# Altium schematic sheet MCU_64.SchDoc: MCU
size A4; DocumentNumber: MB1136; Revision: C.3; SheetNumber: 2; SheetTotal: 4; Project: NUCLEO-XXXXRX
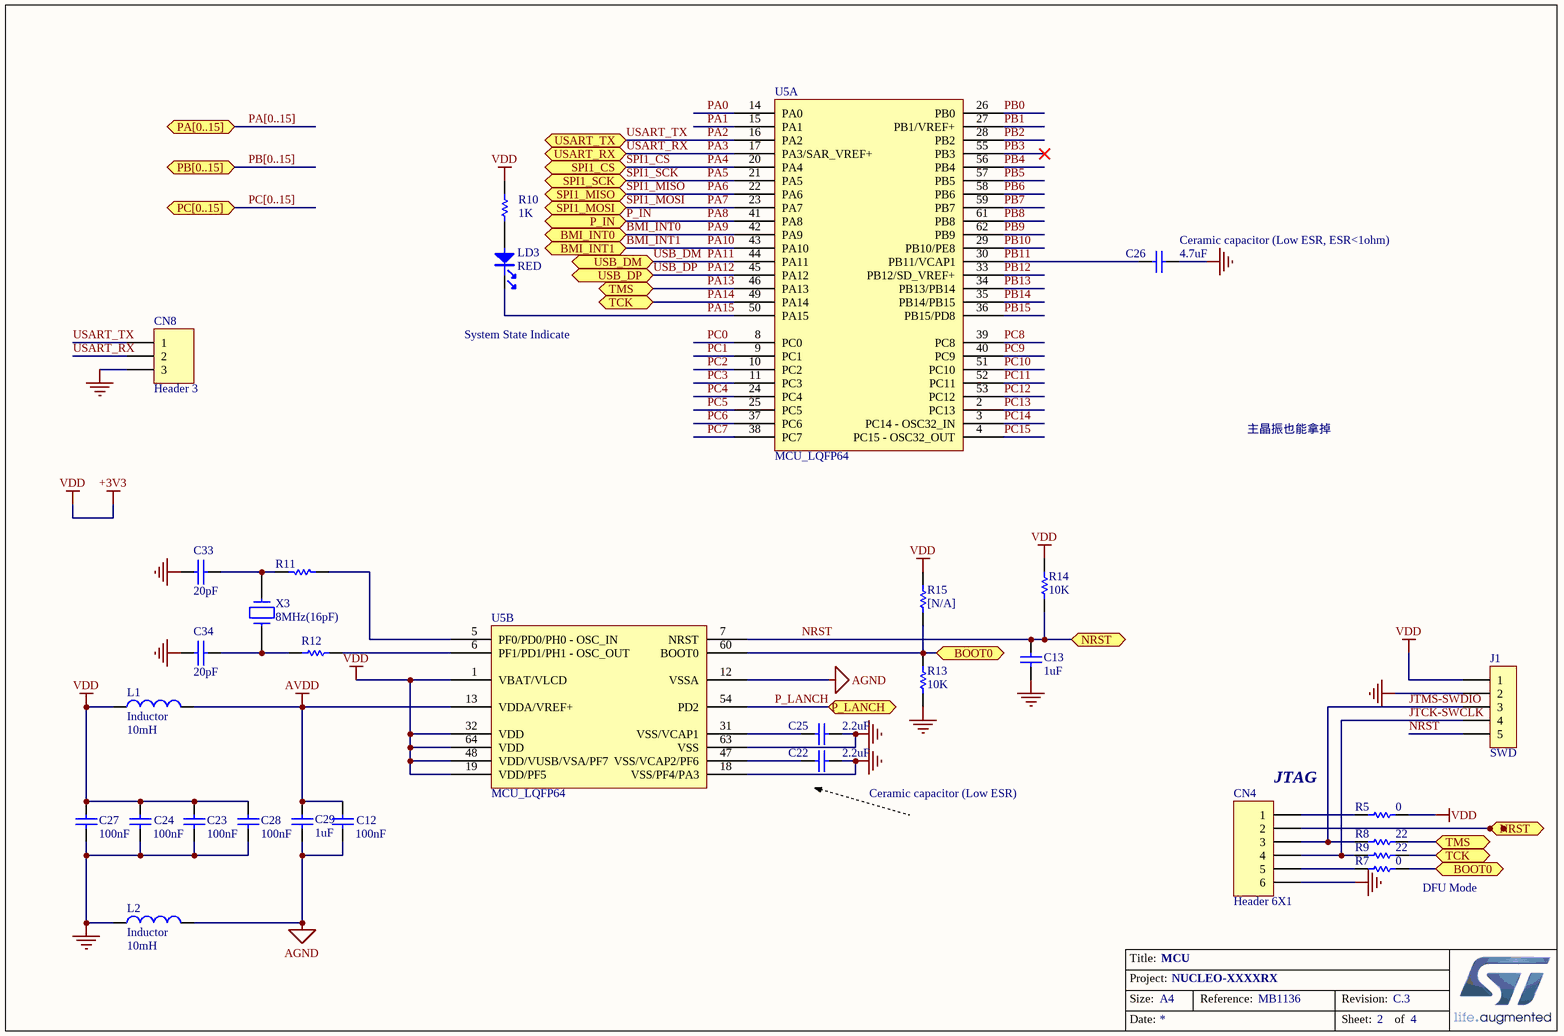
[diagram p0: MCU_64.SchDoc]

## Parts
C12  100nF  [0603C]
C13  1uF  [0603C]
C22  2.2uF  [C-0805]
C23  100nF  [0603C]
C24  100nF  [0603C]
C25  2.2uF  [C-0805]
C26  4.7uF  [C-0805]
C27  100nF  [0603C]
C28  100nF  [0603C]
C29  1uF  [0603C]
C33  20pF  [0603C]
C34  20pF  [0603C]
CN4  Header 6X1  [HDR1X6]
CN8  Header 3  [HDR1X3]
J1  SWD  [HDR1X5]
L1  Inductor  value 10mH  [0603R]
L2  Inductor  value 10mH  [0603R]
LD3  RED  [0603D]
R5  0  [0603R]
R7  0  [0603R]
R8  22  [0603R]
R9  22  [0603R]
R10  1K  [0603R]
R11  (no value)  [0603R]
R12  (no value)  [0603R]
R13  10K  [0603R]
R14  10K  [0603R]
R15  [N/A]  [0603R]
U5  MCU_LQFP64  [LQFP64]  (parts A,B of 2)
X3  8MHz(16pF)  [X-1105/A-JL]

## Ports
BMI_INT0 (bidir), BMI_INT1 (bidir), BOOT0, NRST, P_IN (bidir), P_LANCH, PA[0..15] (bidir), PB[0..15] (bidir), PC[0..15] (bidir), SPI1_CS (bidir), SPI1_MISO (bidir), SPI1_MOSI (bidir), SPI1_SCK (bidir), TCK, TMS, USART_RX (bidir), USART_TX (bidir), USB_DM (bidir), USB_DP (bidir)

## Nets
+3V3: C23.1 C24.1 C27.1 C28.1 J1.1 L1.1 R5.2 R10.2 R14.1 R15.1 U5.1(VBAT/VLCD) U5.19(VDD/PF5) U5.32(VDD) U5.48(VDD/VUSB/VSA/PF7) U5.64(VDD)  [also labelled VDD]
AGND: C12.2 C29.2 L2.2 U5.12(VSSA)
AVDD: C12.1 C29.1 L1.2 U5.13(VDDA/VREF+)
GND: C13.2 C22.2 C23.2 C24.2 C25.2 C26.2 C27.2 C28.2 C33.2 C34.2 CN4.6 CN8.3 J1.2 L2.1 R13.2 U5.18(VSS/PF4/PA3) U5.63(VSS)
BMI_INT0: U5.42(PA9) ; port BMI_INT0  [also labelled PA9]
BMI_INT1: U5.43(PA10) ; port BMI_INT1  [also labelled PA10]
BOOT0: R7.2 R13.1 R15.2 U5.60(BOOT0) ; port BOOT0
JTCK-SWCLK: CN4.4 J1.4 R9.1
JTMS-SWDIO: CN4.3 J1.3 R8.1
NRST: C13.1 CN4.2 J1.5 R14.2 U5.7(NRST) ; port NRST
P_IN: U5.41(PA8) ; port P_IN  [also labelled PA8]
P_LANCH: U5.54(PD2) ; port P_LANCH
PA0: U5.14(PA0)
PA1: U5.15(PA1)
PA2: CN8.1 U5.16(PA2) ; port USART_TX  [also labelled USART_TX]
PA3: CN8.2 U5.17(PA3/SAR_VREF+) ; port USART_RX  [also labelled USART_RX]
PA4: U5.20(PA4) ; port SPI1_CS  [also labelled SPI1_CS]
PA5: U5.21(PA5) ; port SPI1_SCK  [also labelled SPI1_SCK]
PA6: U5.22(PA6) ; port SPI1_MISO  [also labelled SPI1_MISO]
PA7: U5.23(PA7) ; port SPI1_MOSI  [also labelled SPI1_MOSI]
PA11: U5.44(PA11) ; port USB_DM  [also labelled USB_DM]
PA12: U5.45(PA12) ; port USB_DP  [also labelled USB_DP]
PA13: R8.2 U5.46(PA13) ; port TMS
PA14: R9.2 U5.49(PA14) ; port TCK
PA15: LD3.2 U5.50(PA15)
PB0: U5.26(PB0)
PB1: U5.27(PB1/VREF+)
PB2: U5.28(PB2)
PB3: U5.55(PB3)
PB4: U5.56(PB4)
PB5: U5.57(PB5)
PB6: U5.58(PB6)
PB7: U5.59(PB7)
PB8: U5.61(PB8)
PB9: U5.62(PB9)
PB10: U5.29(PB10/PE8)
PB11: C26.1 U5.30(PB11/VCAP1)
PB12: U5.33(PB12/SD_VREF+)
PB13: U5.34(PB13/PB14)
PB14: U5.35(PB14/PB15)
PB15: U5.36(PB15/PD8)
PC0: U5.8(PC0)
PC1: U5.9(PC1)
PC2: U5.10(PC2)
PC3: U5.11(PC3)
PC4: U5.24(PC4)
PC5: U5.25(PC5)
PC6: U5.37(PC6)
PC7: U5.38(PC7)
PC8: U5.39(PC8)
PC9: U5.40(PC9)
PC10: U5.51(PC10)
PC11: U5.52(PC11)
PC12: U5.53(PC12)
PC13: U5.2(PC13)
PC14: U5.3(PC14_-_OSC32_IN)
PC15: U5.4(PC15_-_OSC32_OUT)
NetC22_1: C22.1 U5.47(VSS/VCAP2/PF6)
NetC25_1: C25.1 U5.31(VSS/VCAP1)
NetC33_1: C33.1 R11.2 X3.2
NetC34_1: C34.1 R12.2 X3.1
NetCN4_1: CN4.1 R5.1
NetCN4_5: CN4.5 R7.1
NetLD3_1: LD3.1 R10.1
NetR11_1: R11.1 U5.5(PF0/PD0/PH0_-_OSC_IN)
NetR12_1: R12.1 U5.6(PF1/PD1/PH1_-_OSC_OUT)

## Buses and harness runs
bus PA[0..15] = port PA[0..15]
bus PB[0..15] = port PB[0..15]
bus PC[0..15] = port PC[0..15]

## Notes on the sheet
- (near C26) Ceramic capacitor (Low ESR, ESR<1ohm)
- System State Indicate
- 主晶振也能拿掉
- (near CN4) JTAG
- Ceramic capacitor (Low ESR)
- DFU Mode
- Title:
- Project:
- Size:
- Date:
- A4
- Reference:
- Sheet:
- Revision:
- of

## Library data of the parts
C12 C23 C24 C27 C28 = Cap: Capacitor; Value: 10nF; Published: 8-Jun-2000; Revision: July-2002: Re-released for DXP Platform.; Publisher: Altium Limited
C13 C29 = CAP SMD 0603  X5R 1礔 25V 10%: 0603  X5R 1礔; Rated voltage: 25V; Tolerance: 10%; Manufacturer: *; Manufacturer P/N: *; Order code Farnell: 1288202RL; Value: 1礔; Power: *; Technology: X5R; Temperature  Factor: *; Temperature Max: +125癈; Temperature Min: -55癈; STS Code: *
C22 C25 = Cap_2.2uF_X7R_10%_0805: Capacitor,2.2uF,16V, X7R,10%,0805,YAGEO; Manuf_Part_1: CC0805KKX7R7BB225; Revision: July-2002: Re-released for DXP Platform.; Value: 2.2uF; Order: CC0805KKX7R7BB225; Manuf_1: YAGEO
C26 = Cap_2.2uF_X7R_10%_0805: Capacitor,4.7uF,25V, X7R,10%,1206,YAGEO; Manuf_Part_1: CC0805KKX7R7BB225; Value: 2.2uF; Revision: July-2002: Re-released for DXP Platform.; Order: CC0805KKX7R7BB225; Manuf_1: YAGEO
C33 C34 = CAP: Capacitor
CN4 = Header 6: Header, 6-Pin; LatestRevisionDate: 17-Jul-2002; LatestRevisionNote: Re-released for DXP Platform.; Publisher: Altium Limited
CN8 = Header 3: Header, 3-Pin; LatestRevisionDate: 17-Jul-2002; LatestRevisionNote: Re-released for DXP Platform.; Publisher: Altium Limited
J1 = CON5: Connector
L1 L2 = Inductor: Code_IEC: 1005; Published: 8-Jun-2000; LatestRevisionDate: 29-May-2009; LatestRevisionNote: IPC-7351 Footprint Added.; PackageReference: 0402-A; Publisher: Altium Limited; PackageDescription: Chip Inductor; Code_JEITA: 0402
LD3 = PHOTO
R5 R7-R10 = Resistor_ST: Resistor 0402 / 0603 / 0805; Value: 10K
R11 R12 = Res1: Resistor; Value: 1K; Published: 8-Jun-2000; Revision: July-2002: Re-released for DXP Platform.; Publisher: Altium Limited
R13-R15 = res1: Resistor; Value: 1K; Published: 8-Jun-2000; Revision: July-2002: Re-released for DXP Platform.; Publisher: Altium Limited
X3 = CRYSTAL